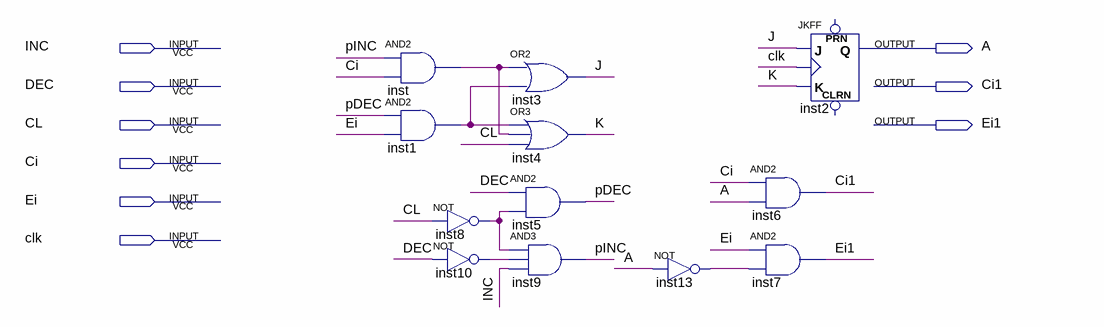
[diagram p0: schematic sheet]
// Quartus schematic REG1_INC_DEC_CL.bdf as structural Verilog: 12 symbols, 9 pins
module REG1_INC_DEC_CL (
  input  INC,
  input  DEC,
  input  CL,
  input  Ci,
  input  Ei,
  input  clk,
  output A,
  output Ci1,
  output Ei1
);

  wire inst1_out, inst8_out, inst10_out, inst13_out, inst_out, J, K, pDEC, pINC;

  and inst (inst_out, pINC, Ci);
  and inst1 (inst1_out, pDEC, Ei);
  not inst8 (inst8_out, CL);
  not inst10 (inst10_out, DEC);
  or inst3 (J, inst_out, inst1_out);
  or inst4 (K, inst1_out, inst_out, CL);
  and inst5 (pDEC, DEC, inst8_out);
  and inst9 (pINC, inst8_out, inst10_out, INC);
  not inst13 (inst13_out, A);
  and inst6 (Ci1, Ci, A);
  and inst7 (Ei1, Ei, inst13_out);
  JKFF inst2 (.K(K), .J(J), .CLK(clk), .Q(A));  // open: PRN, CLRN
endmodule
